# EAGLE design xmegaBreakout (EAGLE 6.6.0)
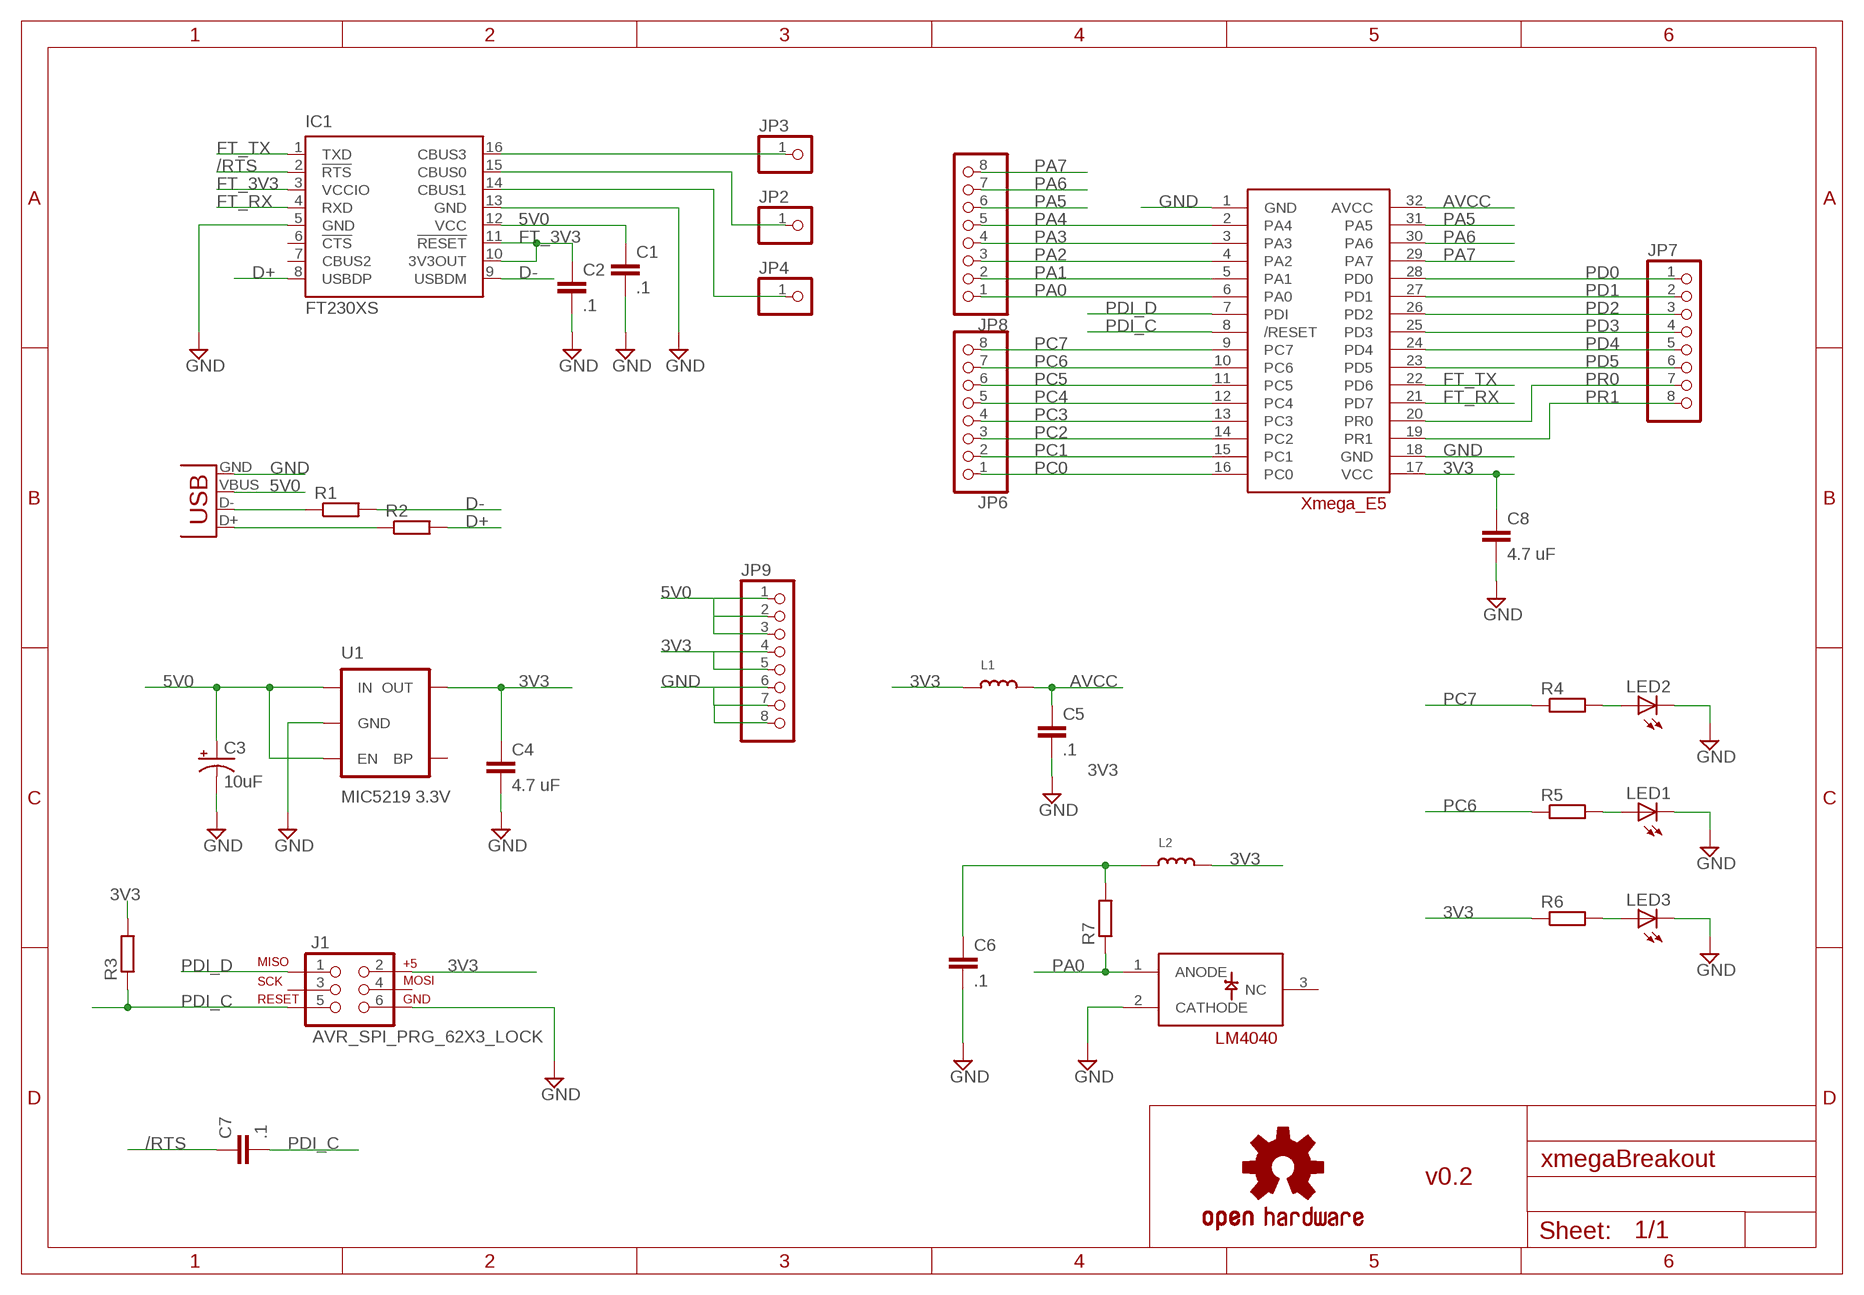
[diagram p0: schematic, sheet 1]

## Parts
C1  .1  C-EUC0603  [C0603]
C2  .1  C-EUC0603  [C0603]
C3  10uF  10UF-TANT  [EIA3216]
C4  4.7 uF  C-EUC0603  [C0603]
C5  .1  C-EUC0603  [C0603]
C6  .1  C-EUC0603  [C0603]
C7  .1  C-EUC0603  [C0603]
C8  4.7 uF  C-EUC0603  [C0603]
IC1  FT230XS  [SSOP16]
J1  AVR_SPI_PRG_62X3_LOCK  [2X3_LOCK]
JP1  USBOLD  [USB-MINIB-OLD]
JP2  HEADER-1X1ROUND  [1X01_ROUND]
JP3  HEADER-1X1ROUND  [1X01_ROUND]
JP4  HEADER-1X1ROUND  [1X01_ROUND]
JP6  HEADER-1X8ROUND  [1X08_ROUND]
JP7  HEADER-1X8ROUND  [1X08_ROUND]
JP8  HEADER-1X8ROUND  [1X08_ROUND]
JP9  HEADER-1X8ROUND  [1X08_ROUND]
L1  INDUCTOR0805  [0805]
L2  INDUCTOR0805  [0805]
LED1  LED0603  [LED-0603]
LED2  LED0603  [LED-0603]
LED3  LED0603  [LED-0603]
LOGO1  OSHW-LOGOS  [OSHW-LOGO-S]
R1  R-EU_R0603  [R0603]
R2  R-EU_R0603  [R0603]
R3  R-EU_R0603  [R0603]
R4  R-EU_R0603  [R0603]
R5  R-EU_R0603  [R0603]
R6  R-EU_R0603  [R0603]
R7  R-EU_R0603  [R0603]
U1  MIC5219 3.3V  V_REG_MIC52193.3V  [SOT23-5]
U$1  IHSAN_XMEGA_E5  [TQFP32-08]
U$2  IHSAN_LM4040  [SOT23-3]

## Nets
3V3: C4.1 C8.1 J1.2 JP9.4 JP9.5 L1.1 L2.2 R3.2 R6.1 U1.5(OUT) U$1.17(VCC)
5V0: C1.1 C3.A(+) IC1.12(VCC) JP1.VBUS JP9.1 JP9.2 JP9.3 U1.1(IN) U1.3(EN)
/RTS: C7.1 IC1.2(!RTS)
AVCC: C5.1 L1.2 U$1.32(AVCC)
D+: IC1.8(USBDP) R2.2
D-: IC1.9(USBDM) R1.2
FT_3V3: C2.1 IC1.3(VCCIO) IC1.10(3V3OUT) IC1.11(!RESET)
FT_RX: IC1.4(RXD) U$1.21(PD7)
FT_TX: IC1.1(TXD) U$1.22(PD6)
GND: C1.2 C2.2 C3.C(-) C4.2 C5.2 C6.2 C8.2 IC1.5(GND) IC1.13(GND) J1.6 JP1.GND JP9.6 JP9.7 JP9.8 LED1.C LED2.C LED3.C U1.2(GND) U$1.1(GND) U$1.18(GND) U$2.2(CATHODE)
N$1: JP1.D- R1.1
N$2: JP1.D+ R2.1
N$3: LED2.A R4.2
N$4: LED1.A R5.2
N$5: IC1.16(CBUS3) JP3.1
N$6: IC1.15(CBUS0) JP2.1
N$7: IC1.14(CBUS1) JP4.1
N$8: LED3.A R6.2
N$9: C6.1 L2.1 R7.2
PA0: JP8.1 R7.1 U$1.6(PA0) U$2.1(ANODE)
PA1: JP8.2 U$1.5(PA1)
PA2: JP8.3 U$1.4(PA2)
PA3: JP8.4 U$1.3(PA3)
PA4: JP8.5 U$1.2(PA4)
PA5: JP8.6 U$1.31(PA5)
PA6: JP8.7 U$1.30(PA6)
PA7: JP8.8 U$1.29(PA7)
PC0: JP6.1 U$1.16(PC0)
PC1: JP6.2 U$1.15(PC1)
PC2: JP6.3 U$1.14(PC2)
PC3: JP6.4 U$1.13(PC3)
PC4: JP6.5 U$1.12(PC4)
PC5: JP6.6 U$1.11(PC5)
PC6: JP6.7 R5.1 U$1.10(PC6)
PC7: JP6.8 R4.1 U$1.9(PC7)
PD0: JP7.1 U$1.28(PD0)
PD1: JP7.2 U$1.27(PD1)
PD2: JP7.3 U$1.26(PD2)
PD3: JP7.4 U$1.25(PD3)
PD4: JP7.5 U$1.24(PD4)
PD5: JP7.6 U$1.23(PD5)
PDI_C: C7.2 J1.5 R3.1 U$1.8(/RESET)
PDI_D: J1.1 U$1.7(PDI)
PR0: JP7.7 U$1.20(PR0)
PR1: JP7.8 U$1.19(PR1)
Unconnected: IC1.6(!CTS) IC1.7(CBUS2) J1.3 J1.4 U1.4(BP) U$2.3(NC)

## Notes on the sheet
- v0.2

## Library data of the parts
C1 C2 C4-C8 = rcl:C-EU: CAPACITOR, European symbol
C3 = SparkFun-Capacitors:10UF-TANT: 10uF Tantalum SMT CAP-00811- 16V 10% (EIA-3216); PROD_ID: CAP-00811
IC1 = ftdichip:FT230X: USB to BASIC UART IC Auto generated by make-symbol-device-package-bsdl.ulp Rev. 43 Source: Data sheet <http://www.ftdichip.com/Support/Documents/DataSheets/ICs/DS_FT230X.pdf>
J1 = SparkFun-Connectors:AVR_SPI_PRG_6: AVR ISP 6 Pin This is the reduced ISP connector for AVR programming. Common on Arduino. This footprint will take up less PCB space and can be used with a 10-pin to 6-pin adapter such as SKU: BOB-08508
JP1 = SparkFun-Connectors:USB: USB Connectors USB-B-PTH is fully proven SKU : PRT-00139/CONN-08278 USB-miniB is fully proven SKU : PRT-00587 USB-A-PCB is untested. USB-A-H is throughly reviewed, but untested. Spark Fun Electronics SKU : PRT-00437 USB-B-SMT is throughly reviewed, but untested. Needs silkscreen touching up. USB-A-S has not been used/tested USB-MB-H has not been used/tested USB-MICROB has been used. CONN-09505
JP2-JP4 = microbuilder:HEADER-1X1: PIN HEADER
JP6-JP9 = microbuilder:HEADER-1X8: PIN HEADER
L1 L2 = microbuilder:INDUCTOR: Inductors 0603: 10nH Ceramic Inductor - microwire antenna/RF (Digikey: 712-1434-2-ND) 0805: 560nH Ceramic Inductor - RF (Digikey: 553-1047-1-ND) 270nH Ceramic Inductor - Q = 40@250MHz, +-5%, 1 Ohm DC Resistance (Digikey: 535-10506-2-ND) 1007 (2518 Metric) SMT: 10µH 10% 250mOhm 820mA 1007 Inductor (Digikey: 587-2189-1-ND) 22µH 10% 500mOhm 580mA 1007 Inductor (Digikey: 587-2190-1-ND) 47µH 10% 950mOhm 420mA 1007 Inductor (Digikey: 587-2191-1-ND) 47µH 5% 100mOhm 1A 1008 Inductor (Digikey: 732-1816-1-ND) 5.0x5.0mm (Taiyo Yuden NR5040 Series) 6.8µH 20% 2.3A 64mOhm Inductor (Digikey: 587-2374-2-ND) 5.0x5.0mm (TDK VLC5045 Series) 4.7µH 20% 3.3A 34mOhm Inductor (Digikey: 445-6526-1-ND) 6.8µH 20% 2.7A 46mOhm Inductor (Digikey: 445-6527-1-ND) 6.0x6.0mm (TDK VLC6045 Series) 4.7µH 20% 3.8A 27mOhm Inductor (Digikey: 445-6538-2-ND) 6.8µH 20% 3A 41mOhm Inductor (Digikey: 445-6540-1-ND) 6.2µH 30% 2.2A 45mOhm Inductor (Digikey: SRR5028-6R2YCT-ND) - Not TDK VLC6045 but footprint should match 6.0x6.0mm (TDK SLF6045 Series) 6.8uH 30% 2A 33mOhm Inductor (Digikey: 445-4572-1-ND, Mouser: 810-SLF645T6R8N2R0PF)
LED1-LED3 = SparkFun-LED:LED: LEDs Standard schematic elements and footprints for 5mm, 3mm, 1206, and 0603 sized LEDs. 5mm - Spark Fun Electronics SKU : COM-00529 (and others)
LOGO1 = SparkFun-Aesthetics:OSHW-LOGO: Open Source Hardware Logo This logo indicates the piece of hardware it is found on incorporates a OSHW license and/or adheres to the definition of open source hardware found here: http://freedomdefined.org/OSHW
R1-R7 = rcl:R-EU_: RESISTOR, European symbol
U1 = SparkFun-PowerIC:V_REG_MIC5219: V_REG MIC5219 Standard 500mA LDO voltage regulator in SOT-23 layout. Micrel part MIC5219. BP (by-pass) pin is used to lower output noise with 470pF cap, may be left open.; PROD_ID: VREG-09872
U$1 = SparkFun-DigitalIC_ihsan:IHSAN_XMEGA_E5
U$2 = SparkFun-DigitalIC_ihsan:IHSAN_LM4040

## Board
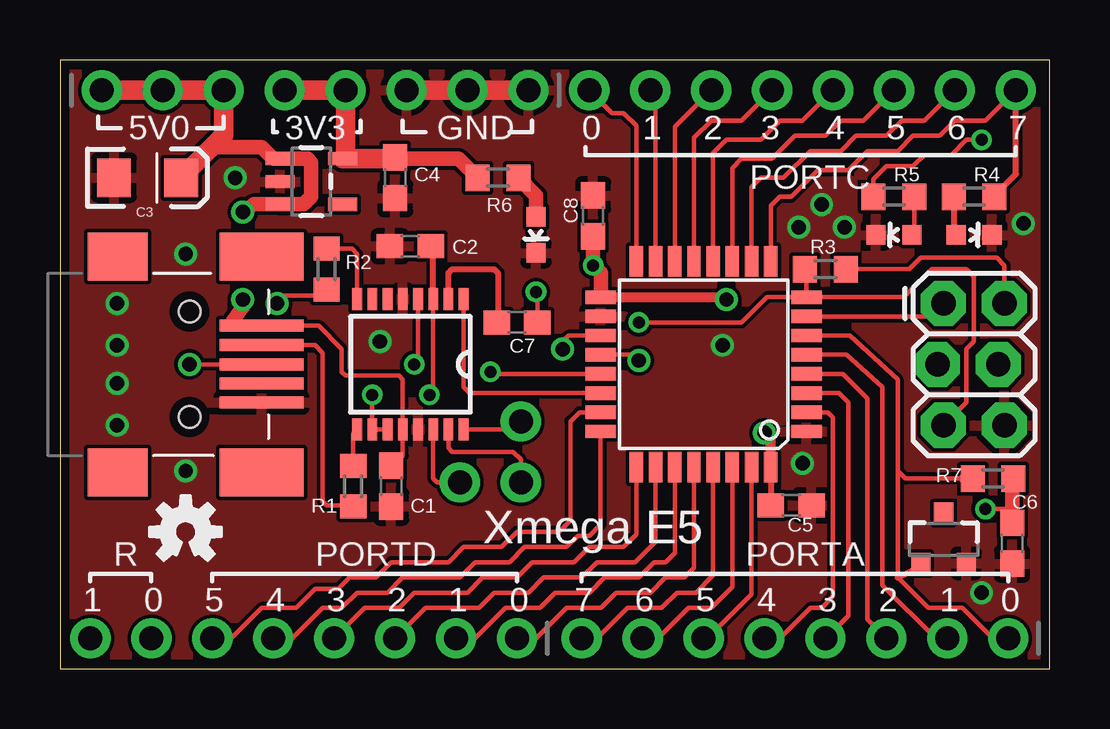
[diagram p1: board, top side]
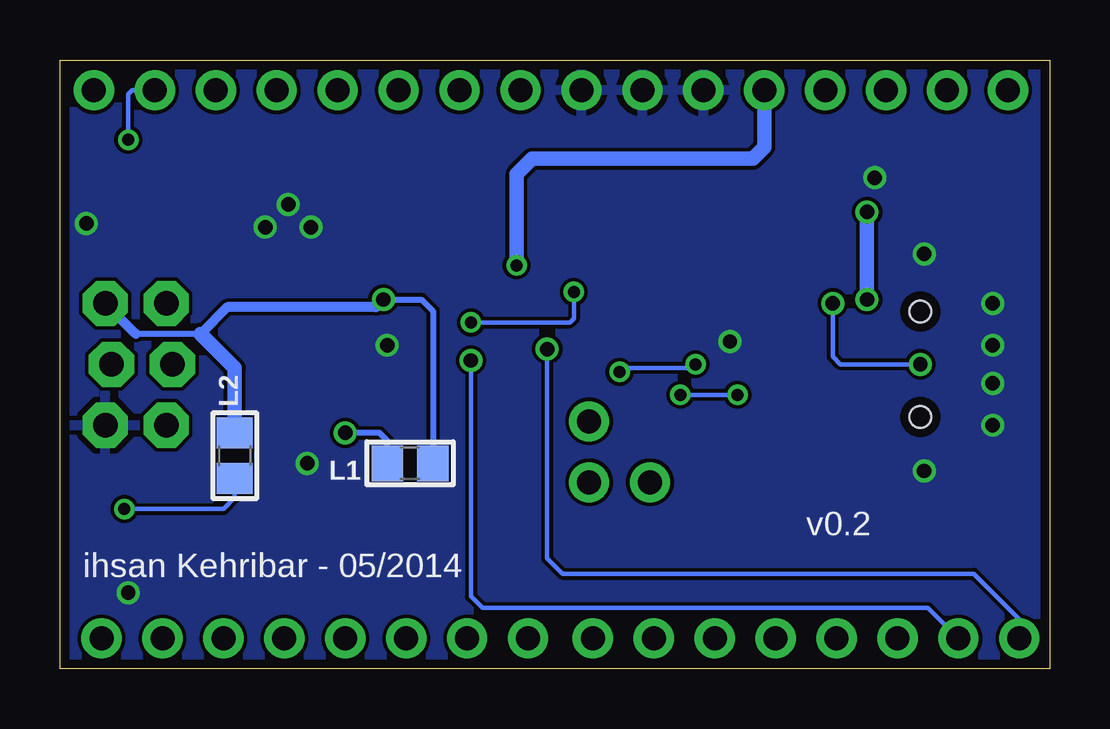
[diagram p2: board, bottom side, seen from below]

Size 41.26 x 25.39 mm. Coordinates in mm from the lower left corner, seen from the top.
Outline: 0,0 41.26,0 41.26,25.39 0,25.39 0,0
Copper layers (1*16): Top 0.0356mm / dielectric 1.5011mm / Bottom 0.0356mm
Design rules "LaenPCBOrder": minimum track width 6mil, minimum drill 13mil, track to track 6mil, track to pad 6mil, pad to pad 6mil, via to via 6mil, smd to smd 6mil, copper to edge 15mil, drill to drill 6mil, minimum pad ring 7mil, minimum via ring 7mil, stop-mask expansion 4mil, vias tented up to drill 0mil, thermal gap 10mil

### Footprints (pad centres in the part's own frame; a part is rotated, then mirrored left to right if it is on the bottom)
C0603 = smd 1.1 x 1: 1 -0.85,0; 2 0.85,0
EIA3216 = smd 1.4 x 1.6: A 1.4,0; C -1.4,0
SSOP16 = smd 0.914 x 0.406: 1 -2.718,2.223; 2 -2.718,1.587; 3 -2.718,0.953; 4 -2.718,0.318; 5 -2.718,-0.318; 6 -2.718,-0.953; 7 -2.718,-1.587; 8 -2.718,-2.223; 9 2.718,-2.223; 10 2.718,-1.587; 11 2.718,-0.953; 12 2.718,-0.318; 13 2.718,0.318; 14 2.718,0.953; 15 2.718,1.587; 16 2.718,2.223
2X3_LOCK = drill 1.016 pad 1.88 octagon: 1 0,0; 2 0,2.54; 3 2.54,-0.254; 4 2.54,2.286; 5 5.08,0; 6 5.08,2.54
USB-MINIB-OLD = smd 2.5 x 2: 1 -3,-4.5; 2 -3,4.5 | smd 3.5 x 2: 3 3,-4.5; 4 3,4.5 | smd 3.5 x 0.5: D+ 3,0; D- 3,0.8; GND 3,-1.6; ID 3,-0.8; VBUS 3.01,1.61 | hole 0.9: 0,2.2; 0,-2.2
1X01_ROUND = drill 1 pad 1.676: 1 0,0
1X08_ROUND = drill 1 pad 1.676: 1 -8.89,0; 2 -6.35,0; 3 -3.81,0; 4 -1.27,0; 5 1.27,0; 6 3.81,0; 7 6.35,0; 8 8.89,0
0805 = smd 1.3 x 1.5: 1 -0.95,0; 2 0.95,0
LED-0603 = smd 0.8 x 0.8: A 0,-0.75; C 0,0.75
R0603 = smd 1 x 1.1: 1 -0.85,0; 2 0.85,0
SOT23-5 = smd 0.55 x 1.2: 1 -0.95,-1.3; 2 0,-1.3; 3 0.95,-1.3; 4 0.95,1.3; 5 -0.95,1.3
TQFP32-08 = smd 1.27 x 0.559: 1 -4.293,2.8; 2 -4.293,2; 3 -4.293,1.2; 4 -4.293,0.4; 5 -4.293,-0.4; 6 -4.293,-1.2; 7 -4.293,-2; 8 -4.293,-2.8; 17 4.293,-2.8; 18 4.293,-2; 19 4.293,-1.2; 20 4.293,-0.4; 21 4.293,0.4; 22 4.293,1.2; 23 4.293,2; 24 4.293,2.8 | smd 0.559 x 1.27: 9 -2.8,-4.293; 10 -2,-4.293; 11 -1.2,-4.293; 12 -0.4,-4.293; 13 0.4,-4.293; 14 1.2,-4.293; 15 2,-4.293; 16 2.8,-4.293; 25 2.8,4.293; 26 2,4.293; 27 1.2,4.293; 28 0.4,4.293; 29 -0.4,4.293; 30 -1.2,4.293; 31 -2,4.293; 32 -2.8,4.293
SOT23-3 = smd 0.8 x 0.9: 1 -0.95,-1; 2 0.95,-1; 3 0,1.1

### Placement (x,y rotation side)
C1  13.81,7.62 270 top
C2  14.61,17.62 180 top
C3  3.65,20.48 0 top
C4  13.97,20.48 270 top
C5  30.48,6.83 0 top
C6  39.69,5.24 270 top
C7  19.05,14.45 0 top
C8  22.23,18.89 90 top
IC1  14.61,12.7 270 top
J1  36.83,15.24 270 top
JP1  5.4,12.7 0 top
JP2  19.21,7.78 0 top
JP3  19.21,10.32 0 top
JP4  16.67,7.78 0 top
JP6  30.96,24.13 0 top
JP7  10.16,1.27 180 top
JP8  30.64,1.27 180 top
JP9  10.64,24.13 0 top
L1  26.67,8.57 180 bottom
L2  33.97,8.89 90 bottom
LED1  34.77,18.1 90 top
LED2  38.1,18.1 270 top
LED3  19.84,18.1 180 top
LOGO1  5.24,5.71 0 top
R1  12.22,7.62 90 top
R2  11.11,16.67 90 top
R3  31.91,16.67 0 top
R4  38.1,19.68 180 top
R5  34.77,19.68 0 top
R6  18.26,20.48 0 top
R7  38.89,7.94 0 top
U1  10.48,20.32 270 top
U$1  26.83,12.7 180 top
U$2  36.83,5.4 0 top

### Tracks (layer width: path | path; a pad name or v marks a point on that pad's centre or on a via)
3V3  (via drill 0.5 pad 0.25, 0.6 pad 0.25)
  Top 0.191: R3.2 35.4,16.67 35.88,17.14 39.05,17.14 39.37,16.83 J1.2
  Top 0.254: 27.68,15.5 v27.78,15.4 | U$1.17
  Top 0.406: U$1.17 27.68,15.5
  Top 0.61: U$1.17 22.54,16.51 v22.23,16.83 C8.1 | 13.97,21.27 16.61,21.27 R6.1
  Top 0.813: C4.1 13.87,21.43 13.97,21.27 U1.5 11.91,21.4 JP9.5 JP9.4
  Bottom 0.254: 35.4,13.97 38.1,13.97 | v27.78,15.4 26.19,15.4 25.72,14.92 L1.1
  Bottom 0.406: 35.4,13.97 34.29,15.08 28.1,15.08 v27.78,15.4 27.68,15.5 | 38.1,13.97 J1.2
  Bottom 0.61: v22.23,16.83 22.23,20.64 21.59,21.27 12.38,21.27 11.91,21.75 JP9.5 | L2.2 33.97,12.54 35.4,13.97
5V0  (via drill 0.6 pad 0.25)
  Top 0.191: 7.46,14.61 7.14,14.61 7.22,14.53 7.44,14.31 JP1.VBUS 10.77,14.31 11.75,13.34 11.75,12.38 11.91,12.22 14.13,12.22 14.29,12.06 IC1.12 14.29,8.89 13.87,8.47 C1.1
  Top 0.61: C3.A 6.32,21.75 8.41,21.75 8.89,21.27 U1.1 10.32,21.27 10.48,21.11 10.48,19.68 10.16,19.37 U1.3 8.1,19.37 v7.62,19.05 | v7.62,15.4 7.62,15.08 7.22,14.53
  Top 0.813: JP9.1 JP9.2 JP9.3 6.83,22.25 C3.A
  Bottom 0.61: v7.62,19.05 v7.62,15.4
/RTS
  Top 0.254: IC1.2 16.19,16.51 16.35,16.67 18.1,16.67 18.26,16.51 18.26,14.5 C7.1
AVCC  (via drill 0.6 pad 0.25)
  Top 0.254: U$1.32 C5.1
  Top 0.406: U$1.32 29.63,9.58 v29.37,9.84
  Bottom 0.254: L1.2 27.62,9.52 27.94,9.84 v29.37,9.84
  Bottom 0.406: v29.37,9.84 29.21,9.68
D+
  Top 0.191: R2.2 12.17,17.52 12.38,17.3 IC1.8
D-
  Top 0.191: R1.2 12.22,9.82 IC1.9
FT_3V3  (via drill 0.5 pad 0.25)
  Top 0.191: IC1.10 IC1.11 13.04,9.98 13.02,10 v13.02,11.43 | v15.4,11.43 15.56,11.59 IC1.3
  Top 0.254: IC1.3 15.56,17.52 C2.1
  Bottom 0.191: v13.02,11.43 v15.4,11.43
FT_RX  (via drill 0.5 pad 0.25)
  Top 0.191: IC1.4 14.92,12.86 v14.76,12.7 | U$1.21 18.02,12.3 v17.94,12.38
  Bottom 0.191: v14.76,12.7 14.92,12.54 17.78,12.54 v17.94,12.38
FT_TX
  Top 0.191: U$1.22 17.07,11.5 16.83,11.75 IC1.1
GND  (via drill 0.6 pad 0.25)
  Top 0.813: JP9.6 JP9.7 JP9.8
  other vias: 2.38,15.24 2.38,13.49 2.38,11.91 2.38,10.16 7.3,20.48 30.96,8.57 30.8,18.41 27.62,13.49 31.75,19.37 32.7,18.41 5.24,17.3 5.24,8.26 13.34,13.65 40.16,18.57 38.42,3.17
  pour Top: 0,0 41.27,0 41.27,25.4 0,25.4
  pour Bottom: 0,0 41.27,0 41.27,25.4 0,25.4
N$1
  Top 0.191: JP1.D- 10.63,13.5 10.95,13.18 10.95,6.99 11.11,6.83 12.17,6.83 R1.1
N$2  (via drill 0.6 pad 0.25)
  Top 0.191: JP1.D+ v5.4,12.7 | v9.05,15.24 9.37,15.56 10.85,15.56 R2.1
  Bottom 0.191: v5.4,12.7 8.73,12.7 9.05,13.02 v9.05,15.24
N$3
  Top 0.254: R4.2 37.25,18.04 LED2.A
N$4
  Top 0.191: R5.2 35.62,18.04 LED1.A
N$5
  Top 0.191: IC1.16 18.87,9.98 JP3.1
N$6
  Top 0.191: IC1.15 16.19,9.21 16.35,9.05 18.89,9.05 19.21,8.73 JP2.1
N$7
  Top 0.191: IC1.14 15.56,7.94 15.72,7.78 JP4.1
N$8
  Top 0.61: LED3.A 19.84,19.74 R6.2
N$9  (via drill 0.5 pad 0.25)
  Top 0.191: R7.2 39.74,6.25 39.69,6.67 v38.58,6.67
  Top 0.61: C6.1 39.69,6.67 39.69,7.88 R7.2
  Bottom 0.191: v38.58,6.67 34.45,6.67 33.97,7.14 L2.1
PA0
  Top 0.191: U$1.6 32.93,13.9 34.92,12.06 34.92,8.26 | 34.92,8.26 34.92,3.81 36.2,2.54 37.62,2.54 38.89,1.27 JP8.1 39.69,1.43 | 37.78,7.94 35.24,7.94 34.92,8.26
  Top 0.254: U$2.1 35.51,4.08 34.92,3.81 | 37.99,7.73 37.99,7.88
  Top 0.61: 37.99,7.88 R7.1 | 37.99,7.73 37.78,7.94
PA1
  Top 0.191: U$1.5 32.78,13.1 34.29,11.75 34.29,3.49 36.51,1.27 JP8.2
PA2
  Top 0.191: U$1.4 32.63,12.3 33.66,11.27 33.66,2.06 JP8.3
PA3
  Top 0.191: U$1.3 32.47,11.5 32.86,11.11 32.86,2.22 JP8.4
PA4
  Top 0.191: U$1.2 32,10.7 32.23,10.48 32.23,3.02 31.75,2.54 31.27,2.54 30,1.27 JP8.5
PA5
  Top 0.191: U$1.31 28.83,3.11 26.99,1.27 JP8.6
PA6
  Top 0.191: U$1.30 28.03,3.42 27.15,2.54 26.19,2.54 24.92,1.27 JP8.7
PA7
  Top 0.191: U$1.29 27.23,3.89 26.51,3.17 25.72,3.17 25.08,2.54 23.65,2.54 22.38,1.27 JP8.8
PC0
  Top 0.191: U$1.16 24.03,22.64 23.5,23.18 23.02,23.18 JP6.1
PC1
  Top 0.191: U$1.15 24.83,23.91 JP6.2
PC2
  Top 0.191: U$1.14 25.63,22.61 JP6.3
PC3
  Top 0.191: U$1.13 26.43,22.14 27.15,22.86 28.42,22.86 JP6.4
PC4
  Top 0.191: U$1.12 27.23,21.51 27.78,22.07 29.21,22.07 30,22.86 30.96,22.86 JP6.5
PC5
  Top 0.191: U$1.11 28.03,20.89 28.42,21.27 29.69,21.27 30.64,22.23 31.91,22.23 32.54,22.86 33.5,22.86 JP6.6
PC6  (via drill 0.5 pad 0.25)
  Top 0.191: U$1.10 28.83,20.1 29.21,20.48 30.16,20.48 31.27,21.59 32.54,21.59 33.18,22.23 34.45,22.23 35.08,22.86 36.04,22.86 JP6.7 | R5.1 33.92,20.42 34.45,20.95 35.56,20.95 36.04,21.43 37.15,21.43 37.78,22.07 v38.42,22.07
  Bottom 0.191: v38.42,22.07 38.42,23.97 38.26,24.13 JP6.7
PC7
  Top 0.191: U$1.9 29.63,19.31 30,19.68 30.48,19.68 31.59,20.8 32.86,20.8 33.66,21.59 34.92,21.59 35.56,22.23 36.67,22.23 37.31,22.86 38.58,22.86 JP6.8
  Top 0.254: R4.1 38.95,19.74 39.85,20.64 JP6.8
PD0
  Top 0.191: U$1.28 26.43,4.2 26.04,3.81 25.24,3.81 24.61,3.17 23.18,3.17 22.54,2.54 21.11,2.54 19.84,1.27 JP7.1
PD1
  Top 0.191: U$1.27 25.63,4.83 25.24,4.45 24.77,4.45 24.13,3.81 22.7,3.81 22.07,3.17 20.64,3.17 20,2.54 18.57,2.54 17.3,1.27 JP7.2
PD2
  Top 0.191: U$1.26 24.83,5.3 23.97,4.45 22.38,4.45 21.75,3.81 20.16,3.81 19.53,3.17 18.1,3.17 17.46,2.54 15.24,2.54 JP7.3
PD3
  Top 0.191: U$1.25 24.03,5.61 23.5,5.08 22.07,5.08 21.43,4.45 19.68,4.45 19.05,3.81 17.62,3.81 16.99,3.17 14.76,3.17 14.13,2.54 12.7,2.54 JP7.4
PD4
  Top 0.191: JP7.5 9.68,1.27 10.95,2.54 11.75,2.54 12.38,3.17 13.65,3.17 14.29,3.81 16.67,3.81 17.3,4.45 18.73,4.45 19.37,5.08 21.11,5.08 21.59,5.56 22.07,5.56 22.54,6.03 U$1.24
PD5
  Top 0.191: U$1.23 21.65,10.7 21.27,10.32 21.27,6.19 20.8,5.71 19.05,5.71 18.41,5.08 16.83,5.08 16.19,4.45 13.81,4.45 13.18,3.81 12.06,3.81 11.59,3.33 10.64,3.33 9.84,2.54 8.41,2.54 7.14,1.27 JP7.6
PDI_C  (via drill 0.5 pad 0.25)
  Top 0.191: J1.5 37.78,11.11 37.78,13.34 38.1,13.65 38.1,16.35 37.78,16.67 36.35,16.67 35.19,15.5 U$1.8 | U$1.8 31.12,16.61 R3.1 | U$1.8 29.47,15.5 28.42,14.45 v24.13,14.45 | C7.2 19.9,15.66 v19.84,15.72
  Bottom 0.191: v24.13,14.45 20,14.45 19.84,14.61 v19.84,15.72
PDI_D
  Top 0.191: U$1.7 36.29,14.7 J1.1
PR0  (via drill 0.6 pad 0.25)
  Top 0.191: U$1.20 23.89,13.1 v24.13,12.86
  Bottom 0.191: v24.13,12.86 24.13,3.02 23.65,2.54 5.08,2.54 JP7.7
PR1  (via drill 0.6 pad 0.25)
  Top 0.191: U$1.19 21.2,13.9 20.95,13.65 v20.95,13.34
  Bottom 0.191: v20.95,13.34 20.95,4.6 20.32,3.97 3.17,3.97 1.27,2.06 JP7.8

### Text on the board
tPlace: 5V0 | 3V3 | GND | 0 | 1 | 2 | 3 | 4 | 5 | 6 | 7 | PORTC | Xmega E5 | R | PORTD | PORTA | 1 | 0 | 5 | 4 | 3 | 2 | 1 | 0 | 7 | 6 | 5 | 4 | 3 | 2 | 1 | 0
bPlace: v0.2 | ihsan Kehribar - 05/2014